# Altium schematic sheet Sensor_template.SchDoc: Sensor Iterface
size 420 x 297 mm; Revision: 1V0; SheetNumber: 1; SheetTotal: 1
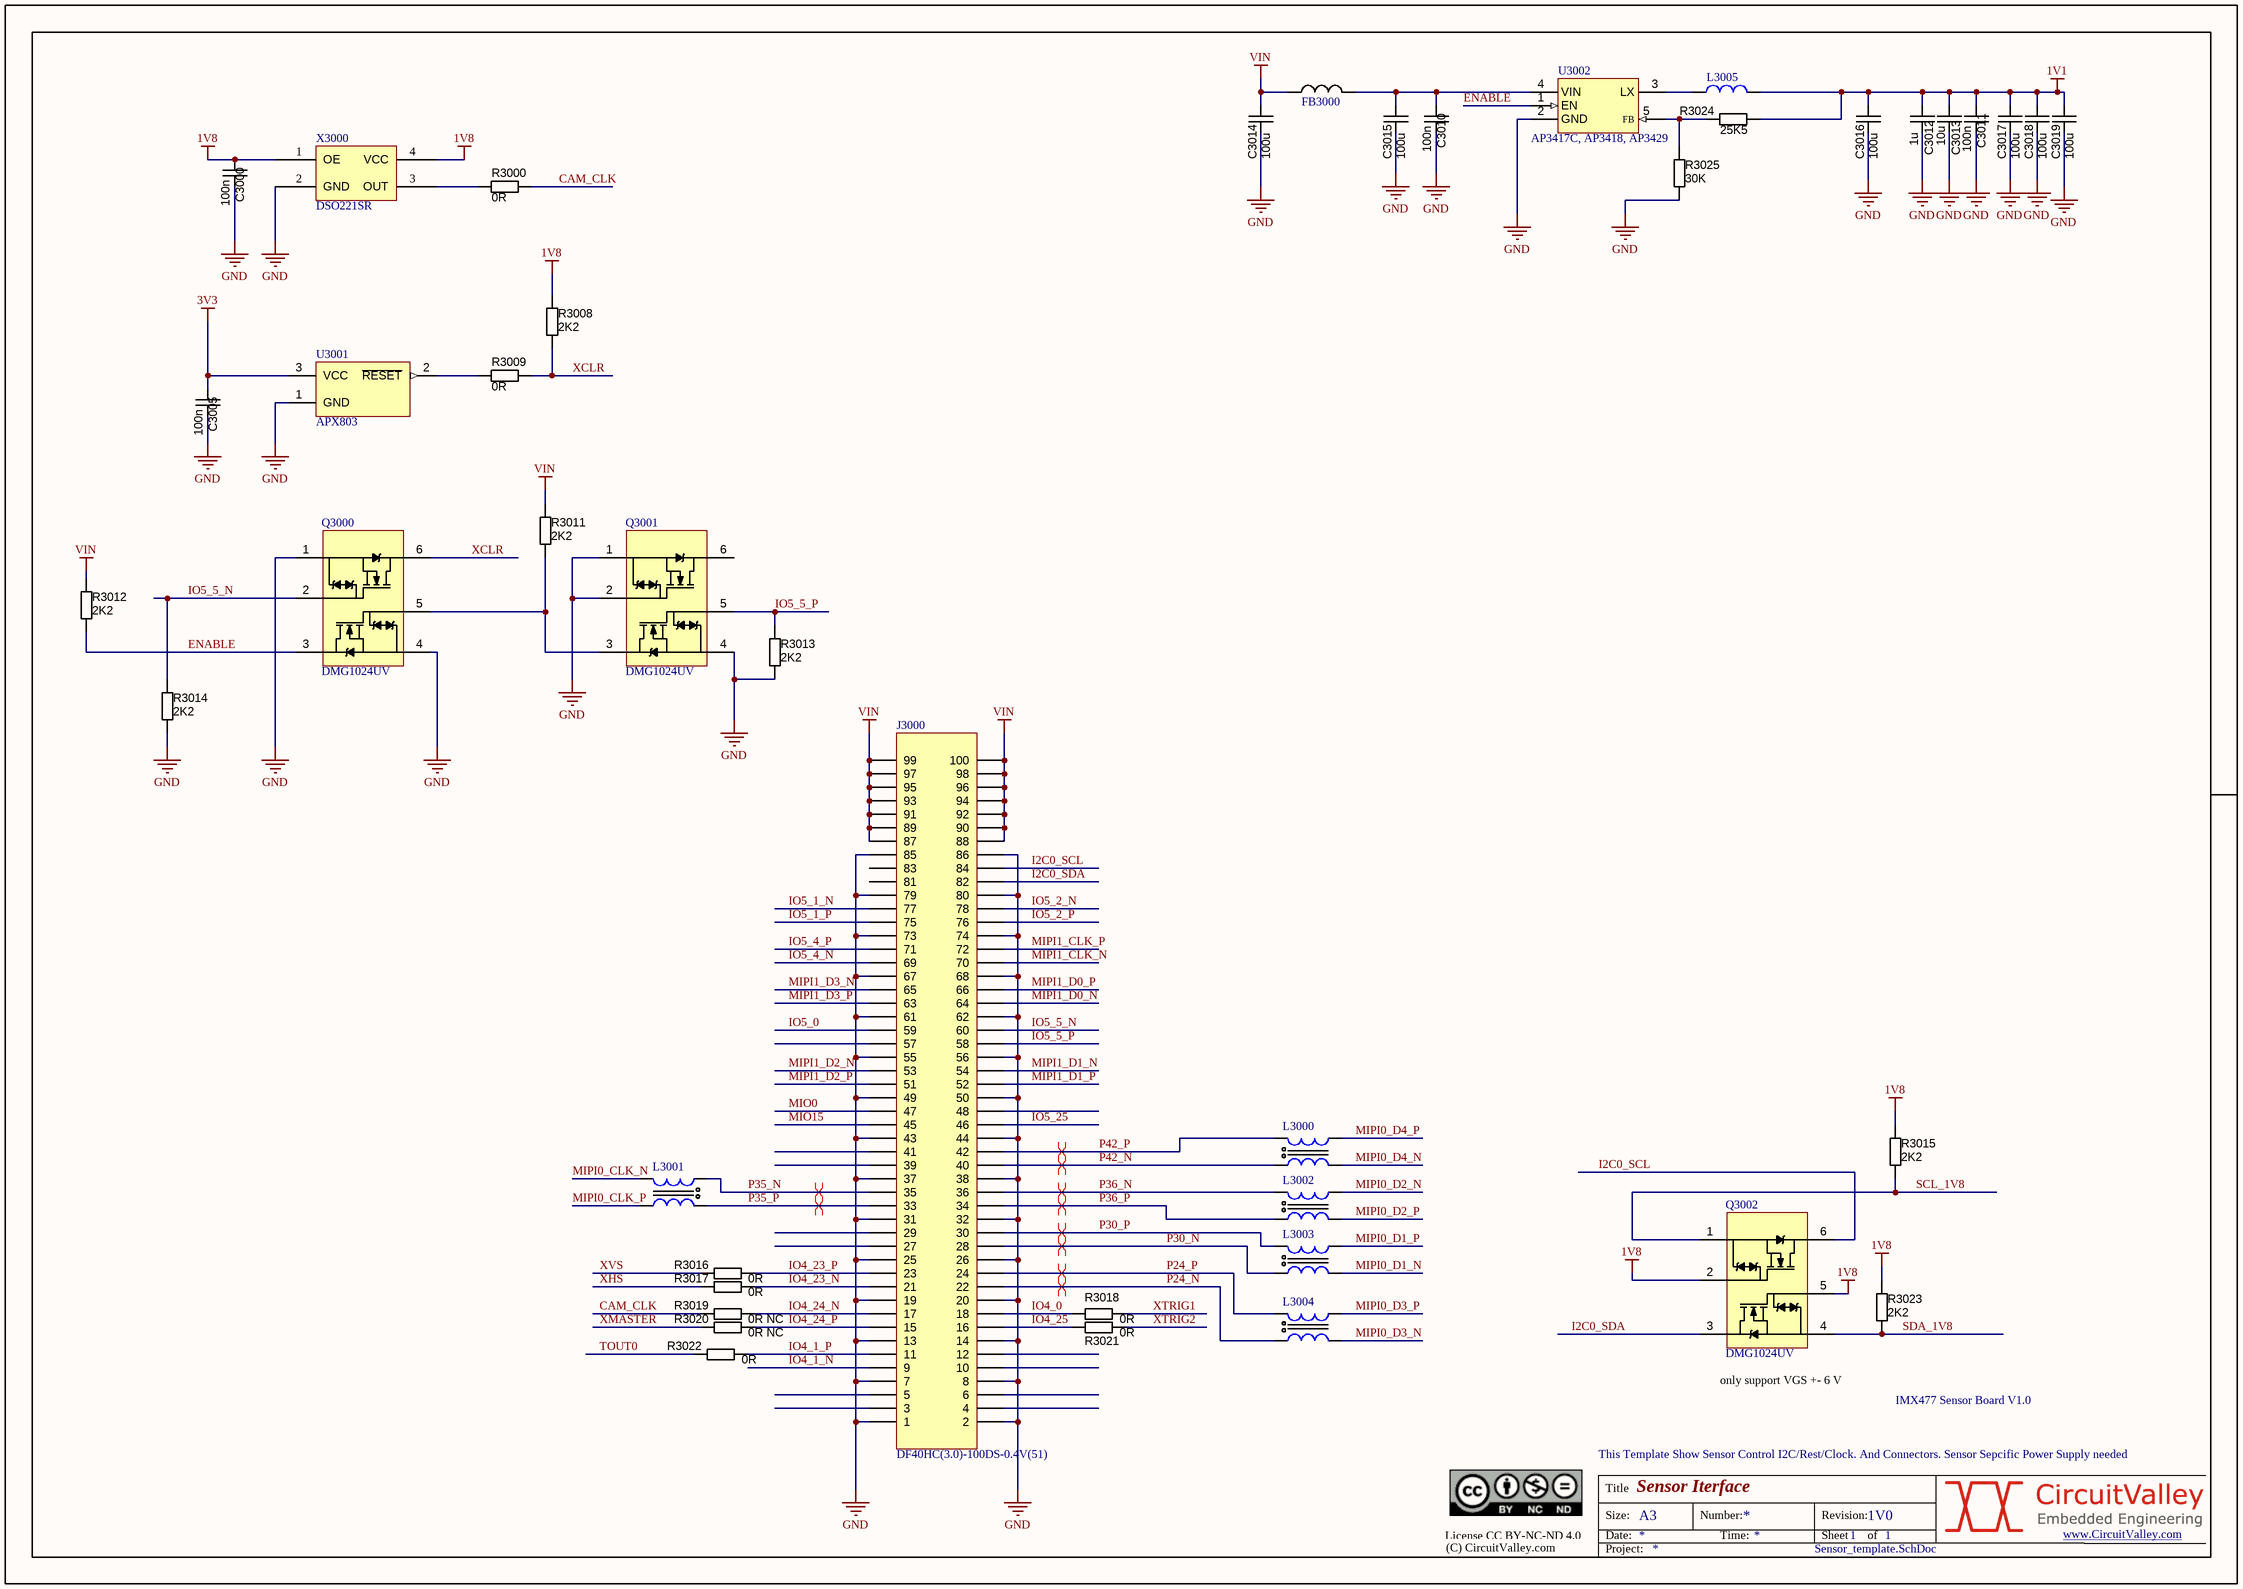
[diagram p0: Sensor_template.SchDoc]

## Parts
C3000  100n  [CAPC1005N]
C3005  100n  [CAPC1005N]
C3010  100n  [CAPC1005N]
C3011  100n  [CAPC1005N]
C3012  value 1u  [CAPC1608N]  (hidden comment: approved sub OK)
C3013  value 10u  [CAPC1608N]  (hidden comment: approved sub OK)
C3014  value 100u  [CAPC2012N]  (hidden comment: approved sub OK)
C3015  value 100u  [CAPC2012N]  (hidden comment: approved sub OK)
C3016  value 100u  [CAPC2012N]  (hidden comment: approved sub OK)
C3017  value 100u  [CAPC2012N]  (hidden comment: approved sub OK)
C3018  value 100u  [CAPC2012N]  (hidden comment: approved sub OK)
C3019  value 100u  [CAPC2012N]  (hidden comment: approved sub OK)
FB3000  Ferrite  [INDC1608N]  (value not drawn)
J3000  DF40HC(3.0)-100DS-0.4V(51)  [DF40HC(3.0)-100DS-0.4V(51)]
L3000  DLM11SN900HZ2L  [DLM11SN900HZ2L]  (value not drawn)
L3001  DLM11SN900HZ2L  [DLM11SN900HZ2L]  (value not drawn)
L3002  DLM11SN900HZ2L  [DLM11SN900HZ2L]  (value not drawn)
L3003  DLM11SN900HZ2L  [DLM11SN900HZ2L]  (value not drawn)
L3004  DLM11SN900HZ2L  [DLM11SN900HZ2L]  (value not drawn)
L3005  DFE252012P-2R2M=P2  [DFE252012P-2R2M=P2]  (value not drawn)
Q3000  DMG1024UV  [SOT563]
Q3001  DMG1024UV  [SOT563]
Q3002  DMG1024UV  [SOT563]
R3000  value 0R  [RESC1005N]  (hidden comment: Thick Film)
R3008  value 2K2  [RESC1005N]  (hidden comment: Thick Film)
R3009  value 0R  [RESC1005N]  (hidden comment: Thick Film)
R3011  value 2K2  [RESC1005N]  (hidden comment: Thick Film)
R3012  value 2K2  [RESC1005N]  (hidden comment: Thick Film)
R3013  value 2K2  [RESC1005N]  (hidden comment: Thick Film)
R3014  value 2K2  [RESC1005N]  (hidden comment: Thick Film)
R3015  value 2K2  [RESC1005N]  (hidden comment: Thick Film)
R3016  value 0R  [RESC1005N]  (hidden comment: Thick Film)
R3017  value 0R  [RESC1005N]  (hidden comment: Thick Film)
R3018  value 0R  [RESC1005N]  (hidden comment: Thick Film)
R3019  value 0R NC  [RESC1005N]  (hidden comment: Thick Film)
R3020  value 0R NC  [RESC1005N]  (hidden comment: Thick Film)
R3021  value 0R  [RESC1005N]  (hidden comment: Thick Film)
R3022  value 0R  [RESC1005N]  (hidden comment: Thick Film)
R3023  value 2K2  [RESC1005N]  (hidden comment: Thick Film)
R3024  value 25K5  [RESC1005N]  (hidden comment: Thick Film)
R3025  value 30K  [RESC1005N]  (hidden comment: Thick Film)
U3001  APX803  [SOT23-3]
U3002  AP3417C, AP3418, AP3429  [SOT23-5]
X3000  DSO221SR  [Active Oscillator 2520]

## Nets
1V1: C3011.2 C3012.1 C3013.1 C3016.1 C3017.1 C3018.1 C3019.1 L3005.2 R3024.2
1V8: C3000.2 Q3002.2(G) Q3002.5(G) R3008.1 R3015.2 R3023.2 X3000.1(OE) X3000.4(VCC)
3V3: C3005.2 U3001.3(VCC)
GND: C3000.1 C3005.1 C3010.1 C3011.1 C3012.2 C3013.2 C3014.2 C3015.2 C3016.2 C3017.2 C3018.2 C3019.2 J3000.1 J3000.2 J3000.7 J3000.8 J3000.13 J3000.14 J3000.19 J3000.20 J3000.25 J3000.26 J3000.31 J3000.32 J3000.37 J3000.38 J3000.43 J3000.44 J3000.49 J3000.50 J3000.55 J3000.56 J3000.61 J3000.62 J3000.67 J3000.68 J3000.73 J3000.74 J3000.79 J3000.80 J3000.85 J3000.86 Q3000.1(S) Q3000.4(S) Q3001.1(S) Q3001.2(G) Q3001.4(S) R3013.1 R3014.2 R3025.1 U3001.1(GND) U3002.2(GND) X3000.2(GND)
VIN: C3014.1 FB3000.1 J3000.87 J3000.88 J3000.89 J3000.90 J3000.91 J3000.92 J3000.93 J3000.94 J3000.95 J3000.96 J3000.97 J3000.98 J3000.99 J3000.100 R3011.2 R3012.1
CAM_CLK: R3000.1 R3019.2
ENABLE: Q3000.3(D) R3012.2 U3002.1(EN)
I2C0_SCL: J3000.84 Q3002.6(D)
I2C0_SDA: J3000.82 Q3002.3(D)
IO4_0: J3000.18 R3018.2
IO4_1_N: J3000.9
IO4_1_P: J3000.11 R3022.1
IO4_23_N: J3000.21 R3017.1
IO4_23_P: J3000.23 R3016.1
IO4_24_N: J3000.17 R3019.1
IO4_24_P: J3000.15 R3020.1
IO4_25: J3000.16 R3021.2
IO5_0: J3000.59
IO5_1_N: J3000.77
IO5_1_P: J3000.75
IO5_2_N: J3000.78
IO5_2_P: J3000.76
IO5_4_N: J3000.69
IO5_4_P: J3000.71
IO5_5_N: J3000.60 Q3000.2(G) R3014.1
IO5_5_P: J3000.58 Q3001.5(G) R3013.2
IO5_25: J3000.46
MIO0: J3000.47
MIO15: J3000.45
MIPI0_CLK_N: L3001.3
MIPI0_CLK_P: L3001.2
MIPI0_D1_N: L3003.2
MIPI0_D1_P: L3003.3
MIPI0_D2_N: L3002.3
MIPI0_D2_P: L3002.2
MIPI0_D3_N: L3004.3
MIPI0_D3_P: L3004.2
MIPI0_D4_N: L3000.2
MIPI0_D4_P: L3000.3
MIPI1_CLK_N: J3000.70
MIPI1_CLK_P: J3000.72
MIPI1_D0_N: J3000.64
MIPI1_D0_P: J3000.66
MIPI1_D1_N: J3000.54
MIPI1_D1_P: J3000.52
MIPI1_D2_N: J3000.53
MIPI1_D2_P: J3000.51
MIPI1_D3_N: J3000.65
MIPI1_D3_P: J3000.63
P24_N: J3000.22 L3004.4
P24_P: J3000.24 L3004.1
P30_N: J3000.28 L3003.1
P30_P: J3000.30 L3003.4
P35_N: J3000.35 L3001.4
P35_P: J3000.33 L3001.1
P36_N: J3000.36 L3002.4
P36_P: J3000.34 L3002.1
P42_N: J3000.40 L3000.1
P42_P: J3000.42 L3000.4
SCL_1V8: Q3002.1(S) R3015.1
SDA_1V8: Q3002.4(S) R3023.1
TOUT0: R3022.2
XCLR: Q3000.6(D) R3008.2 R3009.1
XHS: R3017.2
XMASTER: R3020.2
XTRIG1: R3018.1
XTRIG2: R3021.1
XVS: R3016.2
NetC3010_2: C3010.2 C3015.1 FB3000.2 U3002.4(VIN)
NetL3005_1: L3005.1 U3002.3(LX)
NetQ3000_5: Q3000.5(G) Q3001.3(D) R3011.1
NetR3000_2: R3000.2 X3000.3(OUT)
NetR3009_2: R3009.2 U3001.2(~{RESET})
NetR3024_1: R3024.1 R3025.2 U3002.5(FB)

Not connected (* = marked no-connect by the designer): J3000 3 4 5 6 10 12 27 29 39 41 48 57 81 83; Q3001 6(D)

## Layout directives
differential pair: P24_N, P24_P, P30_N, P30_P, P35_N, P35_P, P36_N, P36_P, P42_N, P42_P

## Notes on the sheet
- only support VGS +- 6 V
- IMX477 Sensor Board V1.0
- This Template Show Sensor Control I2C/Rest/Clock. And Connectors. Sensor Sepcific Power Supply needed
- License CC BY-NC-ND 4.0
- (C) CircuitValley.com
- Title
- Size:
- Date:
- A3
- Number:
- Time:
- Revision:
- Sheet
- of
- www.CircuitValley.com <http://www.CircuitValley.com>
- Project:

## Library data of the parts
C3000 C3005 C3010 C3011 = CAPC_10n_0402_16V_10%: Capacitor SMD Cer 10nF 10% 16V X7R 0402; Manufacturer 1: AVX Corporation; Manufacturer Part Number 1: 0402YC103KAT2A; Ratings: 16V; X7R; Tolerance: ±10%; Operating Temperature: -55°C ~ 125°C; Package / Case: 0402 (1005 Metric); Size / Dimension: 0.039" L x 0.020" W (1.00mm x 0.50mm); Manufacturer 2: Yageo; Manufacturer Part Number 2: CC0402KRX7R7BB103; Supplier 1: Digi-Key; Supplier Part Number 1: 478-1114-1-ND; ComponentLink1URL: http://www.avx.com/docs/Catalogs/cx7r.pdf; ComponentLink1Description: http://www.avx.com/docs/Catalogs/cx7r.pdf; Supplier 2: Digi-Key; Supplier Part Number 2: 311-1042-1-ND; ComponentLink2URL: http://www.yageo.com/documents/recent/UPY-GPHC_X7R_6.3V-to-50V_8.pdf; ComponentLink2Description: http://www.yageo.com/documents/recent/UPY-GPHC_X7R_6.3V-to-50V_8.pdf; Value: 100n
C3012 C3013 = CAPC_560p_0603_5%: Capacitor SMD Cer 560pF 5% 50V NP0 0603; Manufacturer 1: AVX Corporation; Manufacturer Part Number 1: 06035A561JAT2A; Ratings: 50V; NP0; Material: ceramic; Capacitance: 470pF; Package / Case: 0603 (1608 metric); Voltage - Rated: 50V; Mounting Type: Surface Mount, MLCC; Operating Temperature: -55°C ~ 125°C; Applications: General Purpose; Size / Dimension: 0.063" L x 0.032" W (1.60mm x 0.81mm); Height - Seated (Max): -; Thickness (Max): 0.035" (0.90mm); Lead Spacing: -; Lead Style: -; ComponentLink1URL: http://www.avx.com/docs/Catalogs/ccog.pdf; ComponentLink1Description: http://www.avx.com/docs/Catalogs/ccog.pdf; Supplier 1: Digi-Key; Supplier Part Number 1: 478-1184-1-ND
C3014-C3019 = CAPC_1u_0805: Capacitor SMD Cer 1uF 10% 16V X7R 0805; Manufacturer 1: TDK Corporation; Manufacturer Part Number 1: C2012X7R1C105K/1.25; Ratings: 16V; X7R; Material: ceramic; Package / Case: 0805 (2012 metric); Tolerance: ±10%; Supplier 1: Digi-Key; Supplier Part Number 1: 445-1358-1-ND
J3000 = DF40HC(3.0)-100DS-0.4V(51): Hiro 100 pin Connector Receptical
L3000-L3004 = Choke
L3005 = inductor_smd: Value: 2u2
R3000 R3008 R3009 R3011-R3025 = RES_3K3_0402_5%: Resistor SMD chip 3.3k Ohm 0.063W 5% 0402; Manufacturer 1: Yageo; Manufacturer Part Number 1: RC0402JR-073K3L; Ratings: 1/16 W; Package / Case: 0402 (1005 metric); Tolerance: ±5%; Material: Thick Film; Supplier 1: Digi-Key; Supplier Part Number 1: 311-3.3KJRCT-ND; ComponentLink1URL: http://www.yageo.com/documents/recent/PYu-RC0402_51_RoHS_L_6.pdf; ComponentLink1Description: http://www.yageo.com/documents/recent/PYu-RC0402_51_RoHS_L_6.pdf
U3002 = AP3417C
X3000 = Oscillator_2520: Active Oscillator_2520; Value: 37.125M